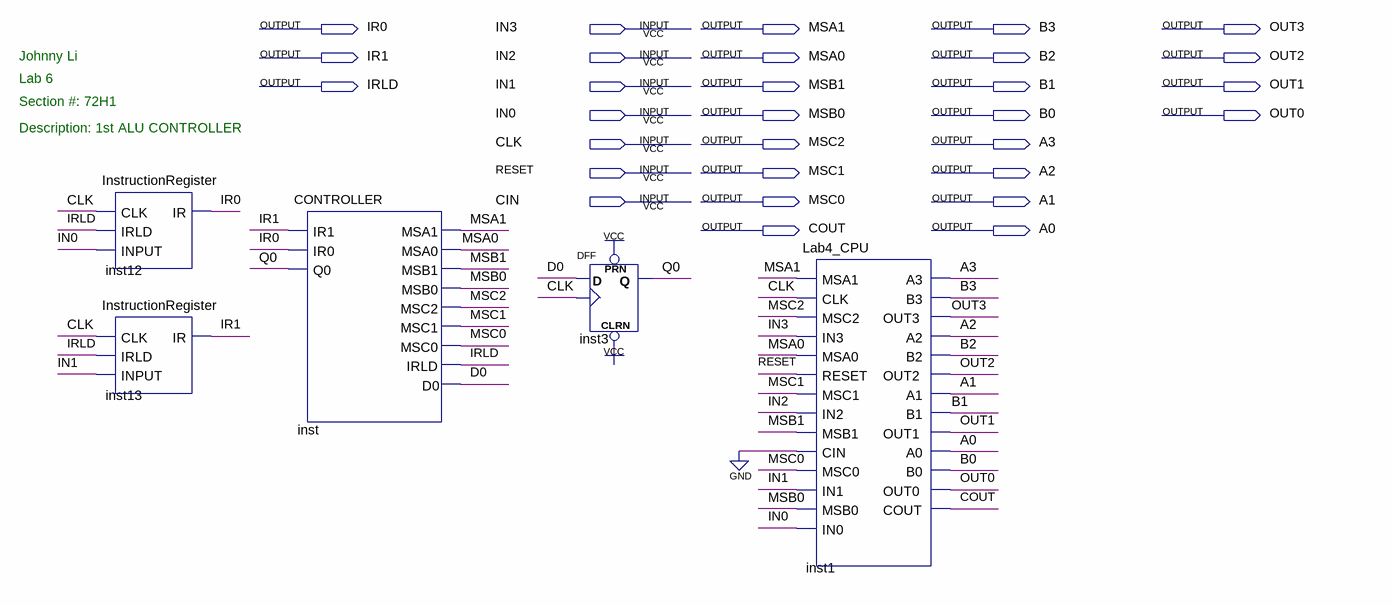
[diagram p0: schematic sheet]
// Quartus schematic LAB6_Part1.bdf as structural Verilog: 5 symbols, 30 pins
module LAB6_Part1 (
  input  IN3,
  input  IN2,
  input  IN1,
  input  IN0,
  input  CLK,
  input  RESET,
  input  CIN,
  output IR0,
  output MSA1,
  output B3,
  output OUT3,
  output IR1,
  output MSA0,
  output B2,
  output OUT2,
  output IRLD,
  output MSB1,
  output B1,
  output OUT1,
  output MSB0,
  output B0,
  output OUT0,
  output MSC2,
  output A3,
  output MSC1,
  output A2,
  output MSC0,
  output A1,
  output COUT,
  output A0
);

  wire D0, Q0;

  InstructionRegister inst12 (.CLK(CLK), .IRLD(IRLD), .INPUT(IN0), .IR(IR0));
  InstructionRegister inst13 (.CLK(CLK), .IRLD(IRLD), .INPUT(IN1), .IR(IR1));
  CONTROLLER inst (
    .IR1(IR1), .IR0(IR0), .Q0(Q0), .MSA1(MSA1), .MSA0(MSA0), .MSB1(MSB1), .MSB0(MSB0), .MSC2(MSC2),
    .MSC1(MSC1), .MSC0(MSC0), .IRLD(IRLD), .D0(D0));
  DFF inst3 (.CLRN(1'b1), .CLK(CLK), .D(D0), .PRN(1'b1), .Q(Q0));
  Lab4_CPU inst1 (
    .MSA1(MSA1), .CLK(CLK), .MSC2(MSC2), .IN3(IN3), .MSA0(MSA0), .RESET(RESET), .MSC1(MSC1), .IN2(IN2),
    .MSB1(MSB1), .CIN(1'b0), .MSC0(MSC0), .IN1(IN1), .MSB0(MSB0), .IN0(IN0), .A3(A3), .B3(B3), .OUT3(OUT3),
    .A2(A2), .B2(B2), .OUT2(OUT2), .A1(A1), .B1(B1), .OUT1(OUT1), .A0(A0), .B0(B0), .OUT0(OUT0), .COUT(COUT));

  // Notes on the sheet:
  //   Johnny Li 
  //   Lab 6 
  //   Section #: 72H1
  //   Description: 1st ALU CONTROLLER
endmodule
